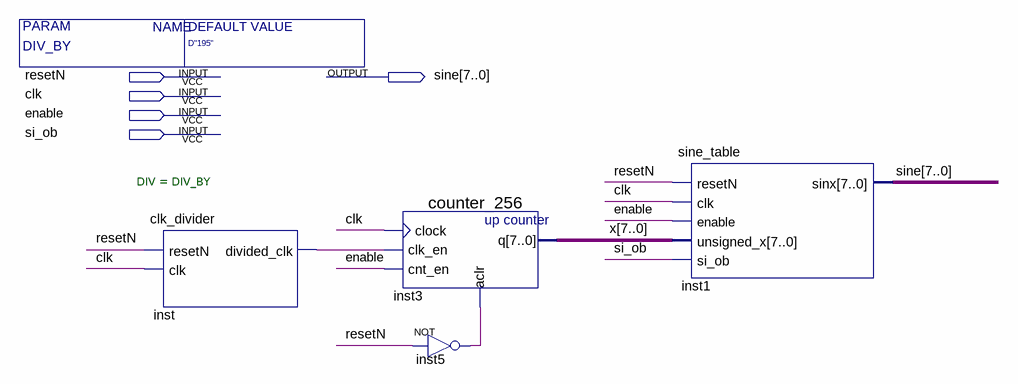
[diagram p0: schematic sheet]
// Quartus schematic sine_wave.bdf as structural Verilog: 4 symbols, 5 pins
module sine_wave #(parameter DIV_BY = "D\"195\"") (
  input  resetN,
  input  clk,
  input  enable,
  input  si_ob,
  output [7:0] sine
);

  wire inst5_out, inst_divided_clk;
  wire [7:0] x;

  clk_divider #(.DIV(DIV_BY)) inst (.resetN(resetN), .clk(clk), .divided_clk(inst_divided_clk));
  counter_256 inst3 (.clock(clk), .clk_en(inst_divided_clk), .cnt_en(enable), .aclr(inst5_out), .q(x));
  not inst5 (inst5_out, resetN);
  sine_table inst1 (.resetN(resetN), .clk(clk), .enable(enable), .unsigned_x(x), .si_ob(si_ob), .sinx(sine));
endmodule
